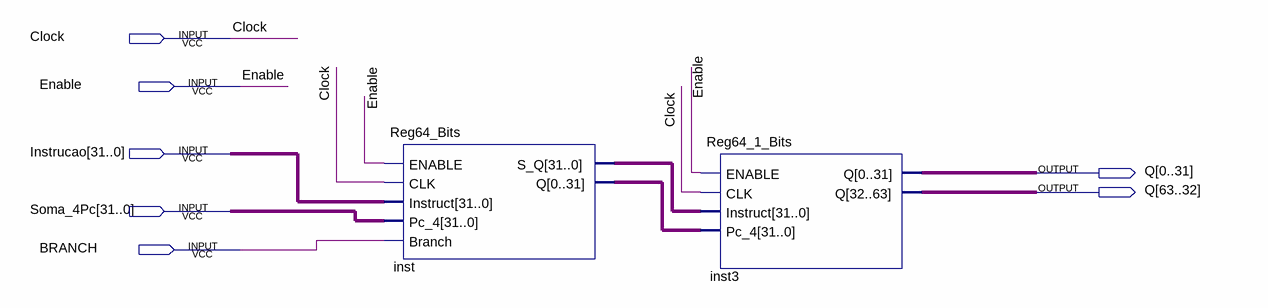
[diagram p0: schematic sheet]
// Quartus schematic IF_ID.bdf as structural Verilog: 2 symbols, 7 pins
module IF_ID (
  input  Clock,
  input  Enable,
  input  [31:0] Instrucao,
  input  [31:0] Soma_4Pc,
  input  BRANCH,
  output [0:63] Q
);

  wire [31:0] inst_q, inst_s_q;

  Reg64_Bits inst (
    .ENABLE(Enable), .CLK(Clock), .Instruct(Instrucao), .Pc_4(Soma_4Pc), .Branch(BRANCH), .S_Q(inst_s_q),
    .Q(inst_q));
  Reg64_1_Bits inst3 (
    .ENABLE(Enable), .CLK(Clock), .Instruct(inst_s_q), .Pc_4(inst_q),
    .Q({Q[32:63], Q[31], Q[30], Q[29], Q[28], Q[27], Q[26], Q[25], Q[24], Q[23], Q[22], Q[21], Q[20], Q[19], Q[18], Q[17], Q[16], Q[15], Q[14], Q[13], Q[12], Q[11], Q[10], Q[9], Q[8], Q[7], Q[6], Q[5], Q[4], Q[3], Q[2], Q[1], Q[0]}));
endmodule
